# Altium schematic sheet MCU098_05_XDS110_Target_Interface.SchDoc: XDS110-ET Interface
size 431 x 279 mm; DrawnBy: Johnson He; SheetNumber: 5; SheetTotal: 7; PageSetup: Record=PageOptions|CenterHorizontal=True|CenterVertical=True|PrintScale=0.97|XCorrection=1.00|YCorrection=1.00|PrintKind=0|BorderSize=5000000|LeftOffset=0|BottomOffset=0|Orientation=2|PaperLength=1000|PaperWidth=1000|Scale=100|PaperSource=15|PrintQuality=600|MediaType=1|DitherType=10|PaperKind=Letter|PrintScaleMode=1
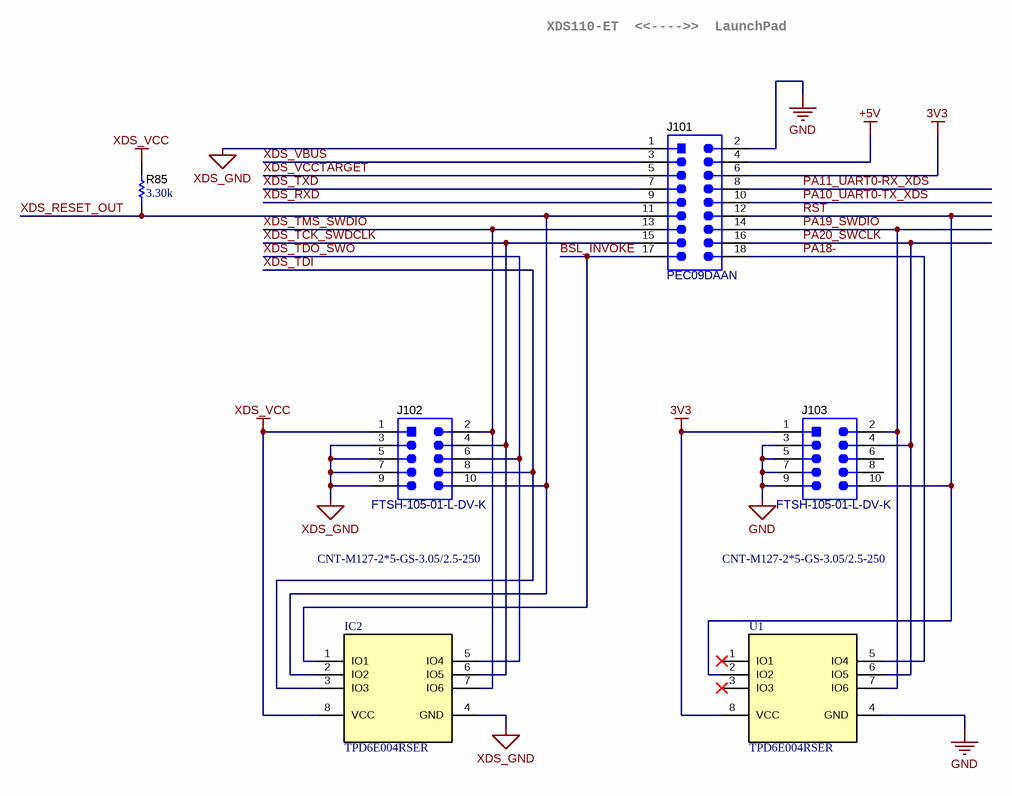
[diagram p0: MCU098_05_XDS110_Target_Interface.SchDoc]

## Parts
IC2  TPD6E004RSER  [RSE0008A]
J101  PEC09DAAN  [Sullins_PxC09DAAN]
J102  FTSH-105-01-L-DV-K  [Samtec_FTSH-105-01-x-DV-K]
J103  FTSH-105-01-L-DV-K  [Samtec_FTSH-105-01-x-DV-K]
R85  ValueDisplayed: 3.30k  [0402]  (hidden comment: ERJ-2RKF3301X)
U1  TPD6E004RSER  [RSE0008A]

## Nets
3V3: J101.6 J103.1 U1.8(VCC)
+5V: J101.4
GND: J101.2 J103.3 J103.5 J103.7 J103.9 U1.4(GND)
XDS_GND: IC2.4(GND) J101.1 J102.3 J102.5 J102.7 J102.9
XDS_VCC: IC2.8(VCC) J102.1 R85.2
BSL_INVOKE: IC2.1(IO1) J101.17
PA10_UART0-TX_XDS: J101.10
PA11_UART0-RX_XDS: J101.8
PA18-: J101.18 U1.5(IO4)
PA19_SWDIO: J101.14 J103.2 U1.7(IO6)
PA20_SWCLK: J101.16 J103.4 U1.6(IO5)
~{RST}: J101.12 J103.10 U1.2(IO2)
XDS_RESET_OUT: IC2.2(IO2) J101.11 J102.10 R85.1
XDS_RXD: J101.9
XDS_TCK_SWDCLK: IC2.6(IO5) J101.15 J102.4
XDS_TDI: IC2.3(IO3) J102.8
XDS_TDO_SWO: IC2.5(IO4) J102.6
XDS_TMS_SWDIO: IC2.7(IO6) J101.13 J102.2
XDS_TXD: J101.7
XDS_VBUS: J101.3
XDS_VCCTARGET: J101.5

Not connected (* = marked no-connect by the designer): J103 6 8; U1 1(IO1)* 3(IO3)*

## Notes on the sheet
- XDS110-ET  <<---->>  LaunchPad
- CNT-M127-2*5-GS-3.05/2.5-250
- Drawn By:
- SVN Rev:
- Number:
- TID #:
- Orderable:
- Rev:
- Sheet Title:
- File:
- Project Title:
- Designed for:
- Assembly Variant:
- Mod. Date:
- Sheet:
- Size:
- of
- B
- http://www.ti.com
- Texas Instruments and/or its licensors do not warrant the accuracy or completeness of this specification or any information contained therein. Texas Instruments and/or its licensors do not warrant that this design will meet the specifications, will be suitable for your application or fit for any particular purpose, or will operate in an implementation. Texas Instruments and/or its licensors do not warrant that the design is production worthy. You should completely validate and test your design implementation to confirm the system functionality for your application.
- Engineer:
- Contact:
- © Texas Instruments

## Library data of the parts
IC2 U1 = CMP-0043125-2: Low-Capacitance + / - 15 kV ESD Protection Array for High-Speed Data Interfaces, 6 Channels, -40 to +85 degC, 8-pin UQFN (RSE), Green (RoHS & no Sb/Br); Manufacturer: Texas Instruments; IO Leakage Current(nA): 1; IO Capacitance(Typ)(pF): 1.6; 1394 / Firewire: TRUE; SubFamily: ESD Solution; Breakdown Voltage(Min)(V): 6; IEC 61000-4-2 Air-Gap(+/- kV): 12; IEC 61000-4-2 Contact(+/- kV): 8; ComponentLink1URL: http://www.ti.com/; PackageDescription: 8-Pin Plastic Quad Flatpack No-Lead, 1.5 x 1.5 mm Body, 0.5 mm Pitch; Serial ATA / eSATA: TRUE; ComponentLink2URL: http://www.ti.com/general/docs/lit/getliterature.tsp?genericPartNumber=TPD6E004&fileType=pdf; ComponentLink3Description: URL Link1; Eco-Plan: Green (RoHS & no Sb/Br); USB High Speed: TRUE; ComponentLink2Description: Datasheet; ComponentLink3URL: SamplesURL:http://www.ti.com/product/tpd6e004#samples; PackageReference: RSE0008A; DatasheetVersion: SLLS799A; PartNumber: TPD6E004RSER; PackageVersion: revD, Jan-2011; Mounting Technology: Surface Mount; ComponentLink1Description: Manufacturer URL
J101 = CMP-0054622-1: Header, 2.54mm, 9x2, Tin, TH; Manufacturer: Sullins Connector Solutions; CNHeader: TRUE; Current_A: 3A; Shrouded: N; Gender: Male; Row_Count: 2; RowSpacing_mm: 2.54; CT: FALSE; Cert_UL: Y; ComponentLink1URL: http://www.sullinscorp.com/catalogs/77_PAGE108-109_.100_MALE_HDR.pdf; ClassName: Header; Publisher: Texas Instruments; Color: Black; RoHS: Y; MountType: TH; Supplier 1: Digi-Key; PackageReference: Header, 2.54mm, 9x2, TH; PinCount: 18; CompType: Header; LatestRevisionDate: 26/05/2017; PartNumber: PEC09DAAN; Orientation: Vertical; ComponentLink1Description: Datasheet URL; Supplier Part Number 1: S2012E-09-ND; Pitch_mm: 2.54; ContactFinish: Tin
J102 J103 = CMP-0075634-1: Header(Shrouded), 1.27mm, 5x2, Gold, SMT; Manufacturer: Samtec; Pitch_mm: 1.27; Gender: Male; Cert_CSA: Y; Current_A: 3.3A; CT: False; Row_Count: 2; ComponentLink1Description: Datasheet URL; RoHS: Y; Supplier 1: Digi-Key; Cert_UL: Y; Orientation: Vertical; PackageReference: Header(Shrouded), 1.27mm, 5x2, SMT; Color: Black; PartNumber: FTSH-105-01-L-DV-K; PinCount: 10; Publisher: Texas Instruments; Supplier Part Number 2: 1872577; ContactFinish: Gold; Supplier 2: Farnell; Shrouded: Y; RowSpacing_mm: 1.27; ComponentLink1URL: http://suddendocs.samtec.com/prints/ftsh-1xx-xx-xxx-dv-xxx-mkt.pdf; LatestRevisionDate: 2017-07-12; CompType: Header; CNHeader: False; MountType: SMT; Supplier Part Number 1: SAM8799-ND
R85 = CMP-0026695-1: RES, 3.30 k, 1%, 0.1 W, AEC-Q200 Grade 0, 0402; Manufacturer: Panasonic; Power_W: 100mW; TempCo: 100 ppm/C; Value_Code: 3k30; U/M: EA; Value: 3.30k; Res_ohm: 3.3k; SizeX_mm: 1; SizeY_mm: 0.5; SizeZ_mm: 0.6; Value2: 0.1W; AEC Qualified: Y; VDC_V: 50V; AEC Grade: 0; AEC Category: Q200; ComponentLink1URL: http://industrial.panasonic.com/cdbs/www-data/pdf/RDA0000/AOA0000C86.pdf; Supplier Part Number 2: 64R5278; Publisher: Texas Instruments; Supplier 2: Newark; Supplier Part Number 3: 667-ERJ-2RKF3301X; Supplier 3: Mouser; Published: 2008-06-26; RoHS: Y; Value1: 1%; MountType: SMT; Supplier 1: Digi-Key; PackageReference: 0402; Tolerance_%: 1%; SizeArea_mm2: 0.5; CompType: Resistor; LatestRevisionDate: 2017-03-09; PartNumber: ERJ-2RKF3301X; ComponentLink1Description: Datasheet link; Supplier Part Number 1: P3.30KLCT-ND; Technology: Thick Film